# EAGLE design Loco-Split (EAGLE 9.7.0)
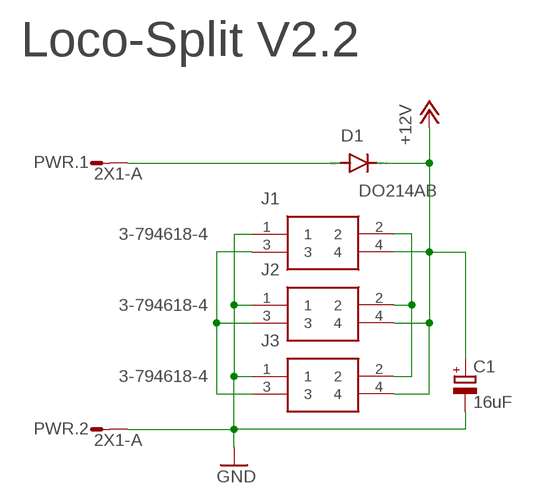
[diagram p0: schematic, sheet 1]

## Parts
C1  16uF  CPOL-EUA/3216-18W  [A/3216-18W]
D1  DO214AB  DIODE-DO214AC  [DO214AC]
J1  3-794618-4  [3-794618-4]
J2  3-794618-4  [3-794618-4]
J3  3-794618-4  [3-794618-4]
PWR  2X1-A  [3-794618-2]

## Nets
+12V: C1.+ D1.C J1.4 J2.4 J3.4
GND: C1.- J1.1 J2.1 J3.1 PWR.2
N$1: D1.A PWR.1
N$3: J1.3 J2.3 J3.3
N$5: J1.2 J2.2 J3.2

## Notes on the sheet
- Loco-Split V2.2

## Library data of the parts
C1 = rcl:CPOL-EU: POLARIZED CAPACITOR, European symbol; SPICEPREFIX: C
D1 = diode:DIODE-: DIODE
J1-J3 = Micro Mate-N-Lok:3-794618-4: 4 way 2 row r/a header Mate-N-Lok Source: Datasheet <https://rs.componentsearchengine.com/Datasheets/2/3-794618-4.pdf>; DESCRIPTION: 4 way 2 row r/a header Mate-N-Lok; HEIGHT: 7.37mm; MANUFACTURER_NAME: TE Connectivity; MANUFACTURER_PART_NUMBER: 3-794618-4
PWR = con-amp-micro-mate-n-lock:2X1

## Net classes
0 default: clearance 0.205 mm

## Board
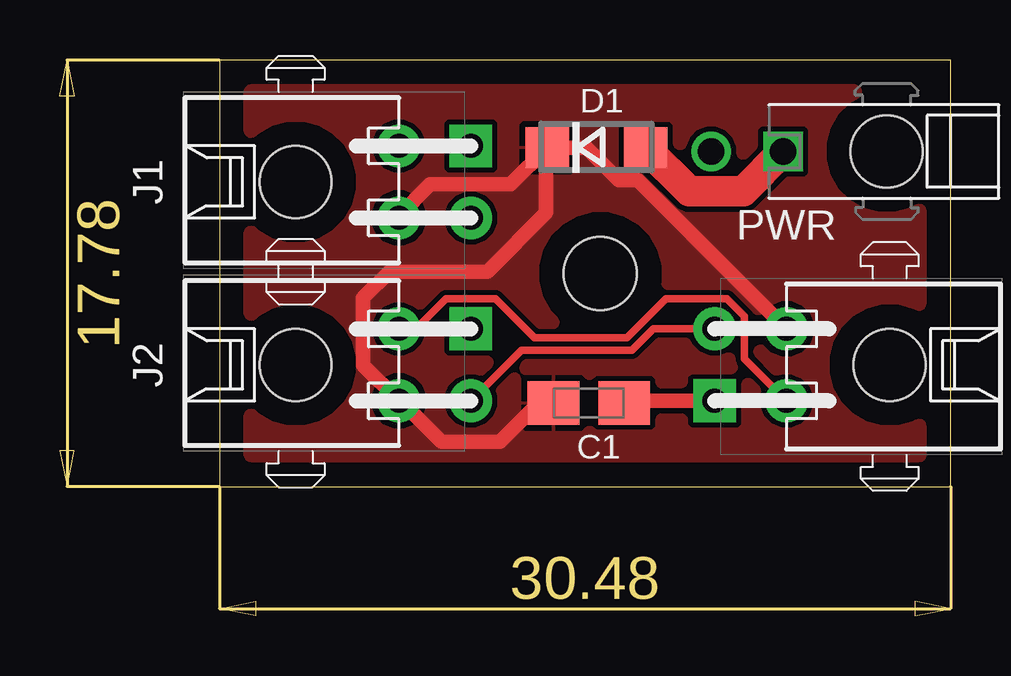
[diagram p1: board, top side]
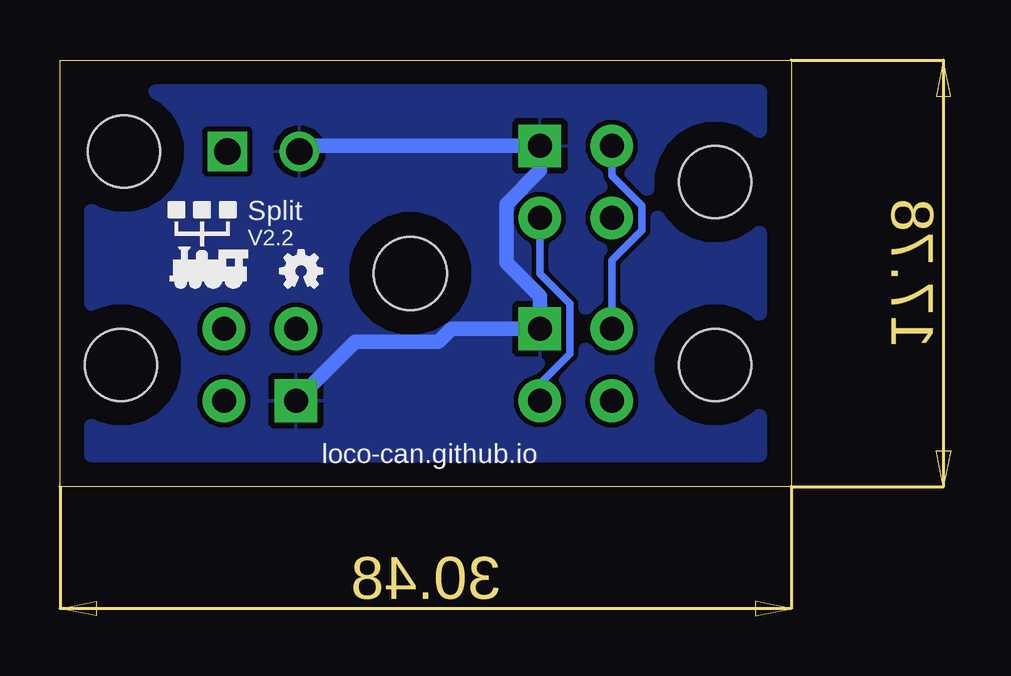
[diagram p2: board, bottom side, seen from below]

Size 30.48 x 17.78 mm. Coordinates in mm from the lower left corner, seen from the top.
Outline: 0,0 30.48,0 30.48,17.78 0,17.78 0,0
Copper layers (1*16): Top / Bottom
Stack-up Default Layer Stack: Top User Defined 0.035mm / Dielectric-1 User Defined 1.5mm / Bottom User Defined 0.035mm
Design rules "default": minimum track width 6mil, minimum drill 0.35mm, track to track 6mil, track to pad 6mil, pad to pad 6mil, via to via 6mil, smd to smd 6mil, copper to edge 40mil, drill to drill 6mil, minimum pad ring 10mil, minimum via ring 8mil, stop-mask expansion 4mil, vias tented up to drill 0mil, thermal gap 10mil
Holes 3.05 mm at 15.88,8.89

### Footprints (pad centres in the part's own frame; a part is rotated, then mirrored left to right if it is on the bottom)
A/3216-18W = smd 2.15 x 1.8: + 1.475,0; - -1.475,0
DO214AC = smd 1.8 x 1.7: A 2.05,0; C -2.05,0
3-794618-4 = drill 1 pad 1.778 square: 1 1.5,-7.3 | drill 1 pad 1.778: 2 1.5,-4.3; 3 -1.5,-7.3; 4 -1.5,-4.3 | hole 3: 0,0
3-794618-2 = drill 1.1 square: 1 0,0 | drill 1.1: 2 0,3 | hole 3: 0,-4.32

### Placement (x,y rotation side)
C1  15.4,3.49 180 top
D1  15.72,14.13 0 top
J1  3.17,12.7 90 top
J2  3.17,5.08 90 top
J3  27.94,5.08 270 top
PWR  23.5,13.97 90 top

### Tracks (layer width: path | path; a pad name or v marks a point on that pad's centre or on a via)
+12V
  Top 0.61: D1.C 12.14,12.6 8.78,12.6 7.47,11.29 J1.4 | D1.C 13.62,14.08 13.62,11.41 11.17,8.96 7.09,8.96 6,7.87 6,5.06 J2.4 7.54,3.58 9.26,1.86 11.7,1.86 13.33,3.49 C1.+ | J3.4 17.45,12.77 16.66,12.77 15.29,14.13 D1.C
  pour Top: 0,17.78 30.48,17.78 30.48,0 0,0
GND
  Top 0.61: J3.1 16.78,3.58 C1.-
  Bottom 0.61: J3.1 18.18,6.04 14.7,6.04 14.16,6.58 J2.1 10.47,7.93 11.87,9.33 11.87,11.78 10.47,13.18 J1.1 20.27,14.2 PWR.2
  pour Bottom: 0,17.78 30.48,17.78 30.48,0 0,0
N$1
  Top 1.27: PWR.1 21.83,12.3 19.59,12.3 D1.A
N$3
  Top 0.305: J3.3 18.09,6.58 17.2,5.69 12.58,5.69 J2.3
  Bottom 0.305: J1.3 10.47,8.86 9.23,7.62 9.23,5.54 10.47,4.3 J2.3
N$5
  Top 0.305: J3.2 21.89,5.33 21.89,7.1 21.16,7.83 18.62,7.83 16.99,6.2 13.14,6.2 11.51,7.83 9.44,7.83 8.19,6.58 J2.2
  Bottom 0.305: J1.2 7.47,12.96 6.23,11.72 6.23,10.68 7.47,9.44 J2.2

### Text on the board
bNames: Split | V2.2 | loco-can.github.io